# Altium project ZHUKONG.PrjPcb
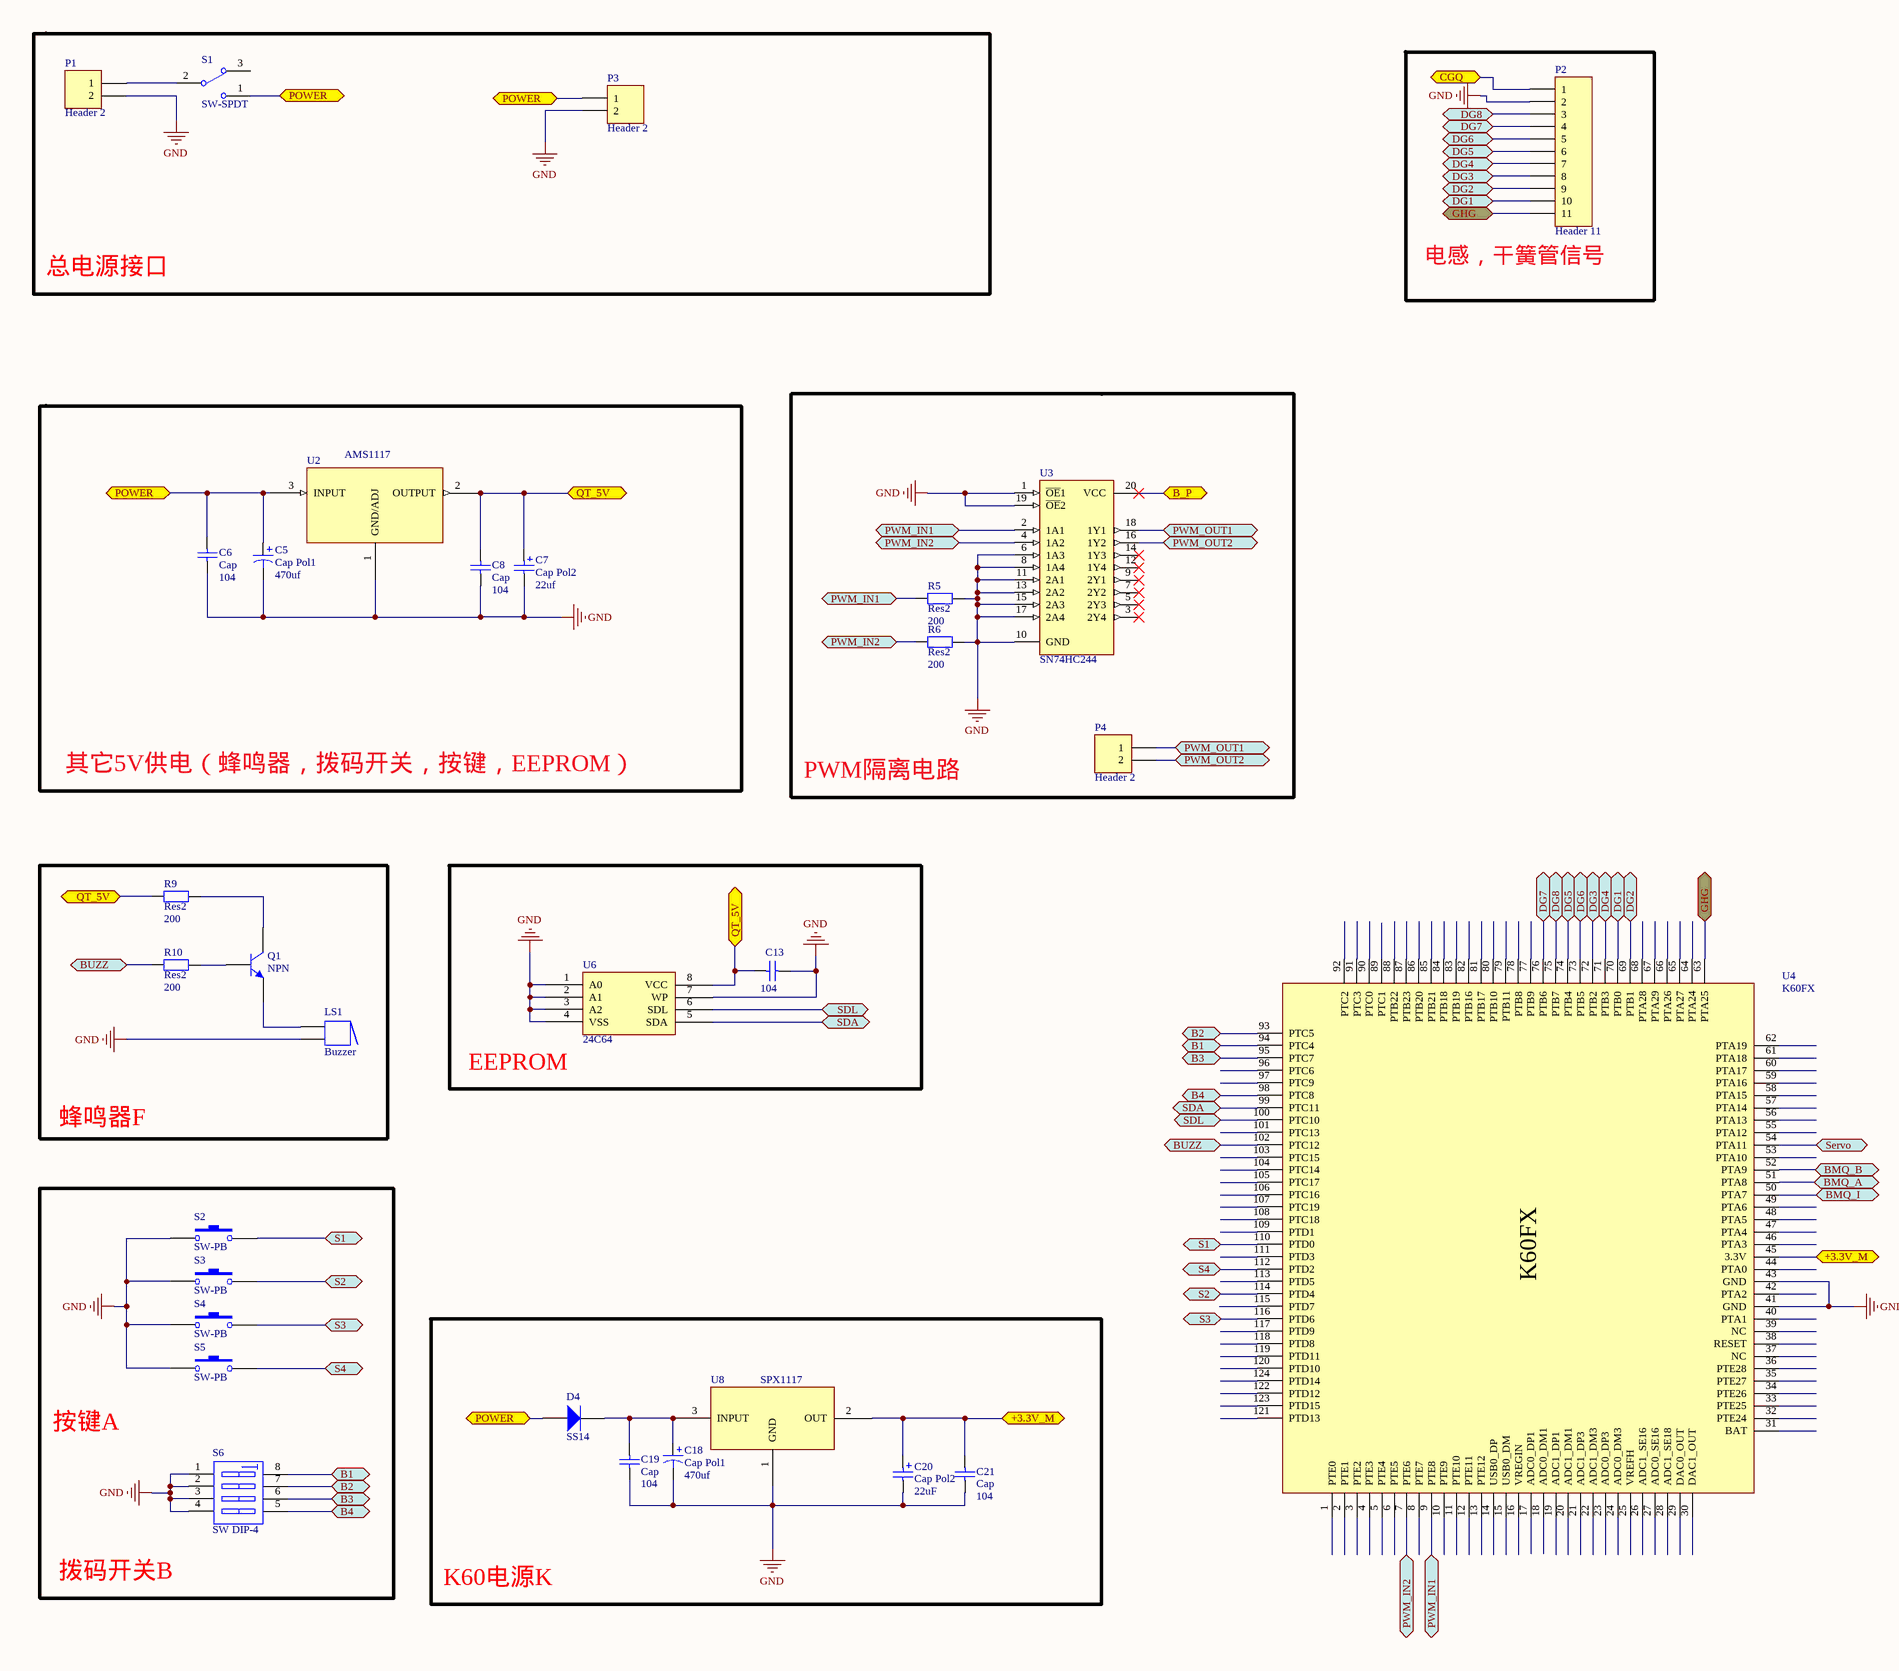
[diagram p0: ZHUKONG.SchDoc, left]
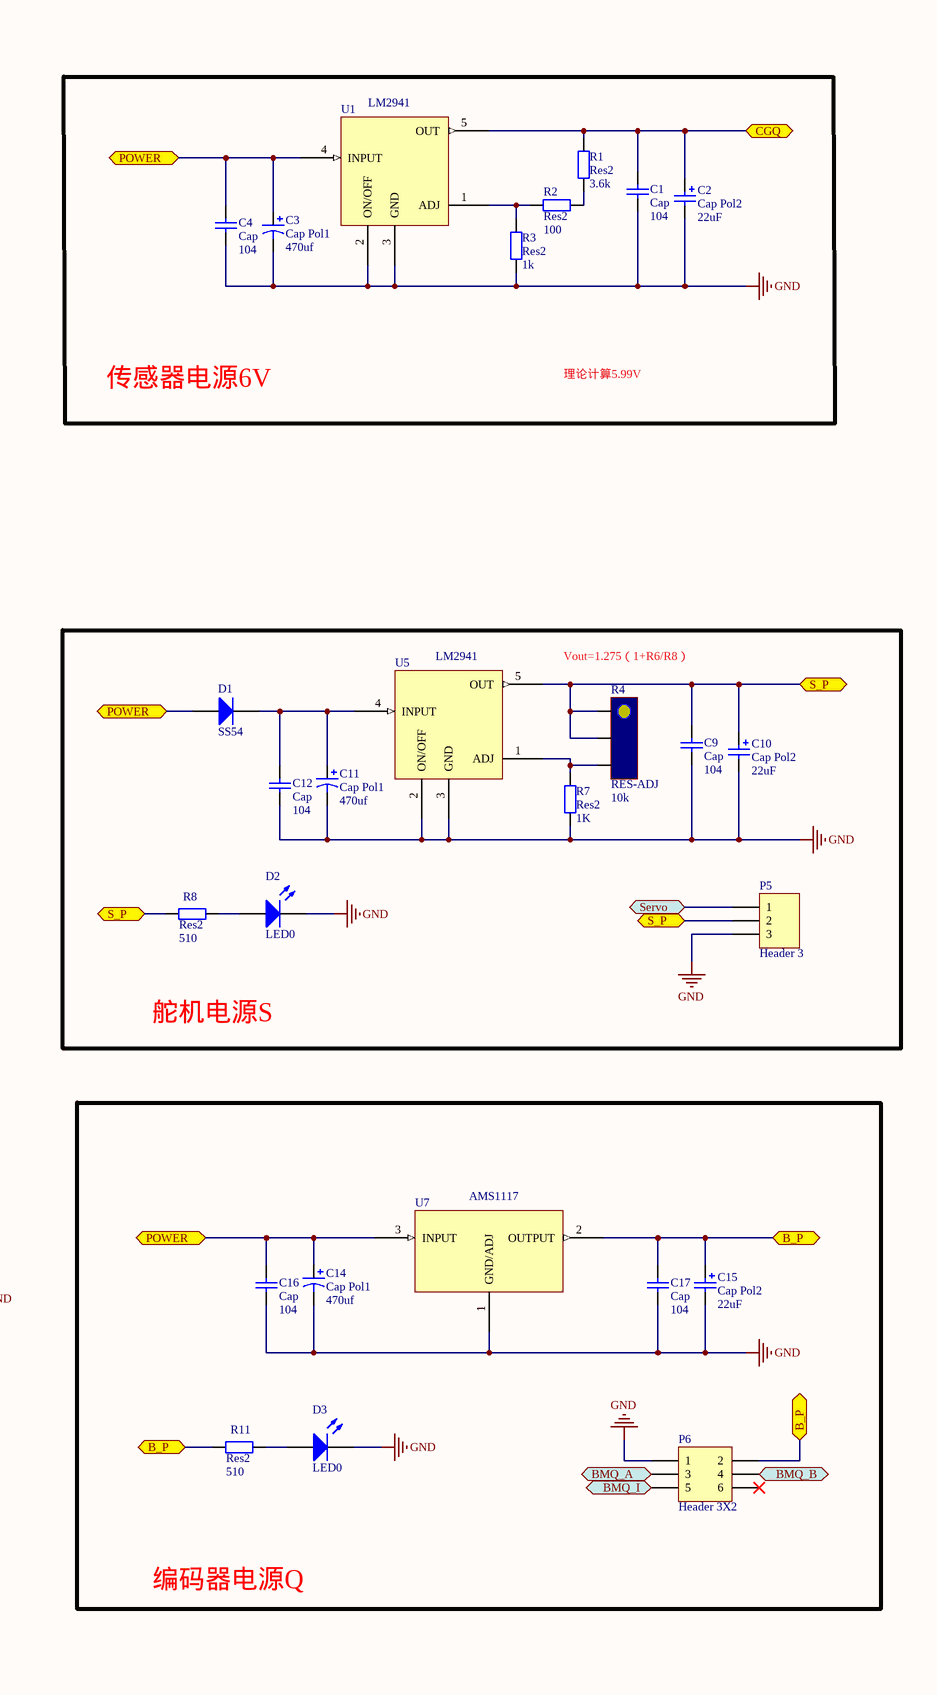
[diagram p1: ZHUKONG.SchDoc, right]
1 sheet, 58 parts. Net scope: flat (ports and power ports of the same name join across sheets).
Board files: ZHUKONG.PcbDoc, carboard.PcbDoc

## Sheet ZHUKONG.SchDoc
size A1

### Parts
C1  Cap  value 104  [C-0805]
C2  Cap Pol2  value 22uF  [1206]
C3  Cap Pol1  value 470uf  [TANCAP]
C4  Cap  value 104  [C-0805]
C5  Cap Pol1  value 470uf  [TANCAP]
C6  Cap  value 104  [C-0805]
C7  Cap Pol2  value 22uf  [1206]
C8  Cap  value 104  [C-0805]
C9  Cap  value 104  [C-0805]
C10  Cap Pol2  value 22uF  [1206]
C11  Cap Pol1  value 470uf  [TANCAP]
C12  Cap  value 104  [C-0805]
C13  value 104  [C-0805]  (hidden comment: Cap)
C14  Cap Pol1  value 470uf  [TANCAP]
C15  Cap Pol2  value 22uF  [1206]
C16  Cap  value 104  [C-0805]
C17  Cap  value 104  [C-0805]
C18  Cap Pol1  value 470uf  [TANCAP]
C19  Cap  value 104  [C-0805]
C20  Cap Pol2  value 22uF  [1206]
C21  Cap  value 104  [C-0805]
D1  SS54  [DO214AA]
D2  LED0  [6-0805_N]
D3  LED0  [6-0805_N]
D4  SS14  [DO214AA]
LS1  Buzzer  [min_bell]
P1  Header 2  [T型插头(公)]
P2  Header 11  [HDR1X11]
P3  Header 2  [接线柱 - min]
P4  Header 2  [HDR1X2]
P5  Header 3  [HDR1X3]
P6  Header 3X2  [SOP6贴片插针]
Q1  NPN  [SOT-23]
R1  Res2  value 3.6k  [0805]
R2  Res2  value 100  [0805]
R3  Res2  value 1k  [0805]
R4  RES-ADJ  value 10k  [T-3224w]
R5  Res2  value 200  [0805]
R6  Res2  value 200  [0805]
R7  Res2  value 1K  [0805]
R8  Res2  value 510  [0805]
R9  Res2  value 200  [0805]
R10  Res2  value 200  [0805]
R11  Res2  value 510  [0805]
S1  SW-SPDT  [SWITCH_B]
S2  SW-PB  [贴片开关]
S3  SW-PB  [贴片开关]
S4  SW-PB  [贴片开关]
S5  SW-PB  [贴片开关]
S6  SW DIP-4  [SW-4P]
U1  LM2941  [LM2941]
U2  AMS1117  [AMS1117]
U3  SN74HC244  [SO-20W]
U4  K60FX  [K60_v3]
U5  LM2941  [LM2941]
U6  24C64  [SO-8]
U7  AMS1117  [AMS1117]
U8  SPX1117  [AMS1117]

### Blocks framed on the sheet
总电源接口: P1 P3 S1
电感，干簧管信号: P2
传感器电源6V: C1-C4 R1-R3 U1
其它5V供电（蜂鸣器，拨码开关，按键，EEPROM）: C5-C8 U2
PWM隔离电路: P4 R5 R6 U3
舵机电源S: C9-C12 D1 D2 P5 R4 R7 R8 U5
蜂鸣器F: LS1 Q1 R9 R10
EEPROM: C13 U6
编码器电源Q: C14-C17 D3 P6 R11 U7
K60电源K: C18-C21 D4 U8

### Ports
+3.3V_M, B1, B2, B3, B4, B_P, BMQ_A, BMQ_B, BMQ_I, BUZZ, CGQ, DG1, DG2, DG3, DG4, DG5, DG6, DG7, DG8, GHG, POWER, PWM_IN1, PWM_IN2, PWM_OUT1, PWM_OUT2, QT_5V, S1, S2, S3, S4, S_P, SDA, SDL, Servo

### Nets
GND: C1.2 C2.2 C3.2 C4.2 C5.2 C6.2 C7.2 C8.2 C9.2 C10.2 C11.2 C12.2 C13.2 C14.2 C15.2 C16.2 C17.2 C18.2 C19.2 C20.2 C21.2 D2.2(K) D3.2(K) LS1.2 P1.2 P2.2 P3.2 P5.3 P6.1 R3.1 R5.1 R6.1 R7.1 S2.1 S3.1 S4.1 S5.1 S6.1(A1) S6.2(A2) S6.3(A3) S6.4(A4) U1.2(ON/OFF) U1.3(GND) U2.1(GND/ADJ) U3.1(~{OE}1) U3.6(1A3) U3.8(1A4) U3.10(GND) U3.11(2A1) U3.13(2A2) U3.15(2A3) U3.17(2A4) U3.19(~{OE}2) U4.41(GND) U4.43(GND) U5.2(ON/OFF) U5.3(GND) U6.1(A0) U6.2(A1) U6.3(A2) U6.4(VSS) U6.7(WP) U7.1(GND/ADJ) U8.1(GND)
NetC1_1: C1.1 C2.1 P2.1 R1.2 U1.5(OUT) ; port CGQ
NetC3_1: C3.1 C4.1 C5.1 C6.1 C14.1 C16.1 D1.1 D4.1 P3.1 S1.1 U1.4(INPUT) U2.3(INPUT) U7.3(INPUT) ; port POWER
NetC7_1: C7.1 C8.1 C13.1 R9.1 U2.2(OUTPUT) U6.8(VCC) ; port QT_5V
NetC9_1: C9.1 C10.1 P5.2 R4.2 R4.3 R8.1 U5.5(OUT) ; port S_P
NetC11_1: C11.1 C12.1 D1.2 U5.4(INPUT)
NetC15_1: C15.1 C17.1 P6.2 R11.1 U3.20(VCC) U7.2(OUTPUT) ; port B_P
NetC18_1: C18.1 C19.1 D4.2 U8.3(INPUT)
NetC20_1: C20.1 C21.1 U4.45(3.3V) U8.2(OUT) ; port +3.3V_M
NetD2_1: D2.1(A) R8.2
NetD3_1: D3.1(A) R11.2
NetLS1_1: LS1.1 Q1.2(E)
NetP1_1: P1.1 S1.2
NetP2_3: P2.3 U4.75(PTB7) ; port DG8
NetP2_4: P2.4 U4.76(PTB6) ; port DG7
NetP2_5: P2.5 U4.73(PTB5) ; port DG6
NetP2_6: P2.6 U4.74(PTB4) ; port DG5
NetP2_7: P2.7 U4.71(PTB3) ; port DG4
NetP2_8: P2.8 U4.72(PTB2) ; port DG3
NetP2_9: P2.9 U4.69(PTB1) ; port DG2
NetP2_10: P2.10 U4.70(PTB0) ; port DG1
NetP2_11: P2.11 U4.63(PTA25) ; port GHG
NetP4_1: P4.1 U3.18(1Y1) ; port PWM_OUT1
NetP4_2: P4.2 U3.16(1Y2) ; port PWM_OUT2
NetP5_1: P5.1 U4.54(PTA11) ; port Servo
NetP6_3: P6.3 U4.51(PTA8) ; port BMQ_A
NetP6_4: P6.4 U4.52(PTA9) ; port BMQ_B
NetP6_5: P6.5 U4.50(PTA7) ; port BMQ_I
NetQ1_1: Q1.1(B) R10.2
NetQ1_3: Q1.3(C) R9.2
NetR1_1: R1.1 R2.2
NetR2_1: R2.1 R3.2 U1.1(ADJ)
NetR4_1: R4.1 R7.2 U5.1(ADJ)
NetR5_2: R5.2 U3.2(1A1) U4.9(PTE8) ; port PWM_IN1
NetR6_2: R6.2 U3.4(1A2) U4.7(PTE6) ; port PWM_IN2
NetR10_1: R10.1 U4.102(PTC12) ; port BUZZ
NetS2_2: S2.2 U4.110(PTD0) ; port S1
NetS3_2: S3.2 U4.114(PTD4) ; port S2
NetS4_2: S4.2 U4.116(PTD6) ; port S3
NetS5_2: S5.2 U4.112(PTD2) ; port S4
NetS6_5: S6.5(B4) U4.98(PTC8) ; port B4
NetS6_6: S6.6(B3) U4.95(PTC7) ; port B3
NetS6_7: S6.7(B2) U4.93(PTC5) ; port B2
NetS6_8: S6.8(B1) U4.94(PTC4) ; port B1
NetU4_99: U4.99(PTC11) U6.5(SDA) ; port SDA
NetU4_100: U4.100(PTC10) U6.6(SDL) ; port SDL

Not connected (* = marked no-connect by the designer): P6 6*; S1 3; U3 3(2Y4)* 5(2Y3)* 7(2Y2)* 9(2Y1)* 12(1Y4)* 14(1Y3)*; U4 1(PTE0) 2(PTE1) 3(PTE2) 4(PTE3) 5(PTE4) 6(PTE5) 8(PTE7) 10(PTE9) 11(PTE10) 12(PTE11) 13(PTE12) 14(USB0_DP) 15(USB0_DM) 16(VREGIN) 17(ADC0_DP1) 18(ADC0_DM1) 19(ADC1_DP1) 20(ADC1_DM1) 21(ADC1_DP3) 22(ADC1_DM3) 23(ADC0_DP3) 24(ADC0_DM3) 25(VREFH) 26(ADC1_SE16) 27(ADC0_SE16) 28(ADC1_SE18) 29(DAC0_OUT) 30(DAC1_OUT) 31(BAT) 32(PTE24) 33(PTE25) 34(PTE26) 35(PTE27) 36(PTE28) 37(NC) 38(RESET) 39(NC) 40(PTA1) 42(PTA2) 44(PTA0) 46(PTA3) 47(PTA4) 48(PTA5) 49(PTA6) 53(PTA10) 55(PTA12) 56(PTA13) 57(PTA14) 58(PTA15) 59(PTA16) 60(PTA17) 61(PTA18) 62(PTA19) 64(PTA24) 65(PTA27) 66(PTA26) 67(PTA29) 68(PTA28) 77(PTB9) 78(PTB8) 79(PTB11) 80(PTB10) 81(PTB17) 82(PTB16) 83(PTB19) 84(PTB18) 85(PTB21) 86(PTB20) 87(PTB23) 88(PTB22) 89(PTC1) 90(PTC0) 91(PTC3) 92(PTC2) 96(PTC6) 97(PTC9) 101(PTC13) 103(PTC15) 104(PTC14) 105(PTC17) 106(PTC16) 107(PTC19) 108(PTC18) 109(PTD1) 111(PTD3) 113(PTD5) 115(PTD7) 117(PTD9) 118(PTD8) 119(PTD11) 120(PTD10) 121(PTD13) 122(PTD12) 123(PTD15) 124(PTD14)

### Notes on the sheet
- 理论计算5.99V
- Vout=1.275（1+R6/R8）
- 按键A
- 拨码开关B

### Library data of the parts
C1 C4 C6 C8 C9 C12 C13 C16 C17 C19 C21 = Cap: Capacitor; Published: 8-Jun-2000; LatestRevisionDate: 17-Jul-2002; LatestRevisionNote: Re-released for DXP Platform.; PackageReference: RAD-0.3; Publisher: Altium Limited; PackageDescription: Radial Cap, Thru-Hole; 2 Leads; 0.3 in Pin Spacing
C2 C7 C10 C15 C20 = Cap Pol2: Polarized Capacitor (Axial); Published: 8-Jun-2000; LatestRevisionDate: 17-Jul-2002; LatestRevisionNote: Re-released for DXP Platform.; PackageReference: POLAR0.8; Publisher: Altium Limited; PackageDescription: Polarized Capacitor; 2 Leads
C3 C5 C11 C14 C18 = Cap Pol1: Polarized Capacitor (Radial); Published: 8-Jun-2000; LatestRevisionDate: 17-Jul-2002; LatestRevisionNote: Re-released for DXP Platform.; PackageReference: RB7.6-15; Publisher: Altium Limited; PackageDescription: Polarized Capacitor (Radial); 2 Leads
D1 D4 = Diode BAS16: Silicon Switching Diode for High-Speed Switching; Note: Pin 2 is not connected and not drawn.; Published: 21-Mar-2003; LatestRevisionDate: 29-May-2009; LatestRevisionNote: IPC-7351 Footprint Added.; DatasheetVersion: Oct-1999; PackageVersion: Sep-2001; PackageReference: SOT-23; Publisher: Altium Limited; PackageDescription: 3-Pin SOT-23 Package 0.95 mm Pitch, 2.5 mm Lead Span; ComponentLink1Description: Manufacturer Link; ComponentLink1URL: http://www.infineon.com/; ComponentLink2Description: Datasheet; ComponentLink2URL: http://www.infineon.com/upload/Document/cmc_upload/documents/012/5331/bas16series.pdf
D2 D3 = LED0: Typical INFRARED GaAs LED; Published: 8-Jun-2000; LatestRevisionDate: 08-Jul-2005; LatestRevisionNote: Mech Layer 1 removed.; PackageReference: LED-0; Publisher: Altium Limited; PackageDescription: LED; 2 Leads
LS1 = Buzzer: Magnetic Transducer Buzzer; Published: 24-Mar-1999; LatestRevisionDate: 17-Dec-2003; LatestRevisionNote: Schematic revised, PCB Footprint replaced.; DatasheetVersion: 17-Dec-2003; PackageReference: ABSM-1574; Publisher: Altium Limited; PackageDescription: Magnetic Transducer Buzzer; ComponentLink1Description: Manufacturer Link; ComponentLink1URL: http://www.megastar.com/linecard/buzzmode/index.php
P1 P3 P4 = Header 2: Header, 2-Pin; LatestRevisionDate: 17-Jul-2002; LatestRevisionNote: Re-released for DXP Platform.; Publisher: Altium Limited
P2 = Header 11: Header, 11-Pin; LatestRevisionDate: 17-Jul-2002; LatestRevisionNote: Re-released for DXP Platform.; Publisher: Altium Limited
P5 = Header 3: Header, 3-Pin; LatestRevisionDate: 17-Jul-2002; LatestRevisionNote: Re-released for DXP Platform.; Publisher: Altium Limited
P6 = Header 3X2: Header, 3-Pin, Dual row; LatestRevisionDate: 17-Jul-2002; LatestRevisionNote: Re-released for DXP Platform.; Publisher: Altium Limited
Q1 = NPN: NPN Bipolar Transistor; Published: 8-Jun-2000; LatestRevisionDate: 17-Jul-2002; LatestRevisionNote: Re-released for DXP Platform.; PackageReference: TO-226-AA; Publisher: Altium Limited; PackageDescription: TO, Flat Index; 3 In-Line, Axial Leads; Body Dia. 4.8mm; Leads 0.55 x 0.51 mm (max); Code_JEDEC: TO-226-AA
R1-R3 R5-R11 = Res2: Resistor; Published: 8-Jun-2000; LatestRevisionDate: 17-Jul-2002; LatestRevisionNote: Re-released for DXP Platform.; PackageReference: AXIAL-0.4; Publisher: Altium Limited; PackageDescription: Axial Device, Thru-Hole; 2 Leads; 0.4 in Pin Spacing
S1 = SW-SPDT: SPDT Subminiature Toggle Switch, Right Angle Mounting, Vertical Actuation; Published: 24-Mar-1999; LatestRevisionDate: 17-Dec-2003; LatestRevisionNote: Schematic revised, PCB Footprint replaced.; DatasheetVersion: 05-Dec-2000; PackageReference: TL36WW15050; Publisher: Altium Limited; PackageDescription: Switch; 4 Leads; ComponentLink1Description: Manufacturer Link; ComponentLink1URL: http://www.apem.com
S2-S5 = SW-PB: Switch; Published: 24-Mar-1999; LatestRevisionDate: 17-Jul-2002; LatestRevisionNote: Re-released for DXP Platform.; PackageReference: SPST-2; Publisher: Altium Limited; PackageDescription: Switch; 2 Leads
S6 = SW DIP-4: 编码开关; Published: 24-Mar-1999; LatestRevisionDate: 17-Jul-2002; LatestRevisionNote: Re-released for DXP Platform.; PackageReference: SO8; Publisher: Altium Limited; Code_JEDEC: MS-012-AA; Code_IPC: SO8
U6 = EEPROM_24C64